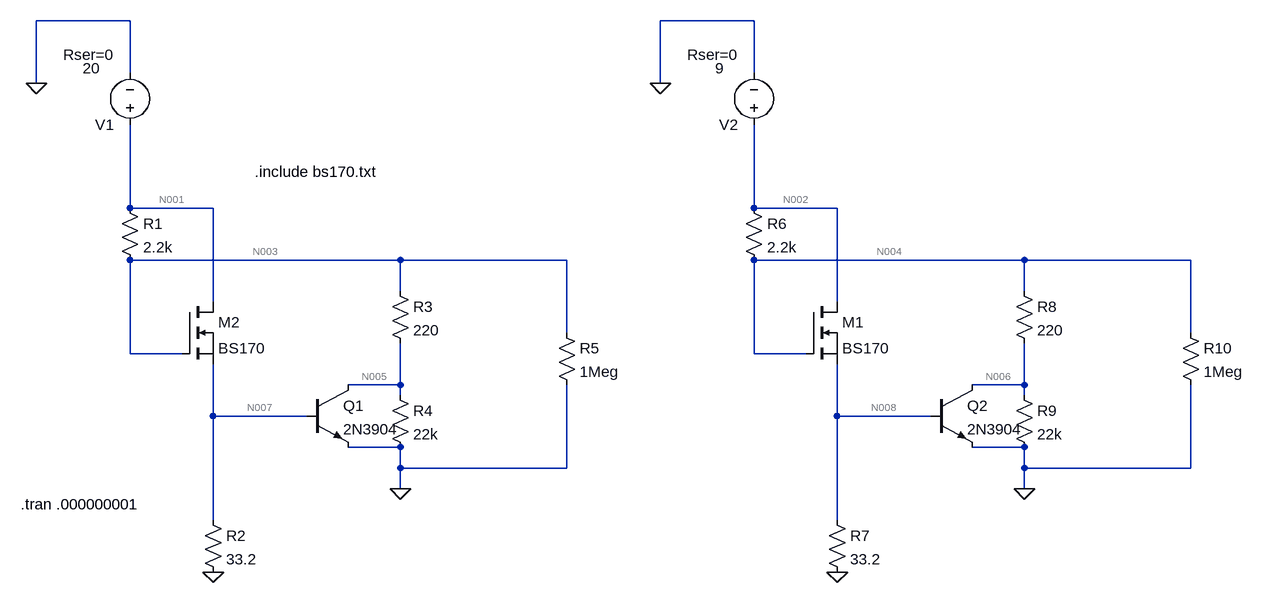
[diagram p0: schematic Bias Reference.asc]
Bias Reference.asc, the LTspice schematic file:
Version 4
SHEET 1 1864 1444
WIRE 144 -80 0 -80
WIRE 1104 -80 960 -80
WIRE 144 0 144 -80
WIRE 1104 0 1104 -80
WIRE 0 16 0 -80
WIRE 960 16 960 -80
WIRE 144 208 144 80
WIRE 272 208 144 208
WIRE 1104 208 1104 80
WIRE 1232 208 1104 208
WIRE 560 288 144 288
WIRE 816 288 560 288
WIRE 1520 288 1104 288
WIRE 1776 288 1520 288
WIRE 560 336 560 288
WIRE 1520 336 1520 288
WIRE 272 352 272 208
WIRE 1232 352 1232 208
WIRE 816 400 816 288
WIRE 1776 400 1776 288
WIRE 144 432 144 288
WIRE 224 432 144 432
WIRE 1104 432 1104 288
WIRE 1184 432 1104 432
WIRE 560 480 560 416
WIRE 560 480 480 480
WIRE 1520 480 1520 416
WIRE 1520 480 1440 480
WIRE 560 496 560 480
WIRE 1520 496 1520 480
WIRE 272 528 272 448
WIRE 416 528 272 528
WIRE 1232 528 1232 448
WIRE 1376 528 1232 528
WIRE 560 576 480 576
WIRE 1520 576 1440 576
WIRE 560 608 560 576
WIRE 816 608 816 480
WIRE 816 608 560 608
WIRE 1520 608 1520 576
WIRE 1776 608 1776 480
WIRE 1776 608 1520 608
WIRE 560 640 560 608
WIRE 1520 640 1520 608
WIRE 272 688 272 528
WIRE 1232 688 1232 528
FLAG 0 16 0
FLAG 272 768 0
FLAG 560 640 0
FLAG 960 16 0
FLAG 1232 768 0
FLAG 1520 640 0
SYMBOL voltage 144 96 R180
WINDOW 123 0 0 Left 0
WINDOW 39 24 124 Left 2
WINDOW 3 46 103 Left 2
SYMATTR SpiceLine Rser=0
SYMATTR Value 20
SYMATTR InstName V1
SYMBOL res 128 192 R0
SYMATTR InstName R1
SYMATTR Value 2.2k
SYMBOL res 256 672 R0
SYMATTR InstName R2
SYMATTR Value 33.2
SYMBOL res 544 320 R0
SYMATTR InstName R3
SYMATTR Value 220
SYMBOL res 544 480 R0
SYMATTR InstName R4
SYMATTR Value 22k
SYMBOL npn 416 480 R0
SYMATTR InstName Q1
SYMATTR Value 2N3904
SYMBOL res 800 384 R0
SYMATTR InstName R5
SYMATTR Value 1Meg
SYMBOL nmos 224 352 R0
SYMATTR InstName M2
SYMATTR Value BS170
SYMATTR Prefix X
SYMBOL voltage 1104 96 R180
WINDOW 123 0 0 Left 0
WINDOW 39 24 124 Left 2
WINDOW 3 46 103 Left 2
SYMATTR SpiceLine Rser=0
SYMATTR Value 9
SYMATTR InstName V2
SYMBOL res 1088 192 R0
SYMATTR InstName R6
SYMATTR Value 2.2k
SYMBOL res 1216 672 R0
SYMATTR InstName R7
SYMATTR Value 33.2
SYMBOL res 1504 320 R0
SYMATTR InstName R8
SYMATTR Value 220
SYMBOL res 1504 480 R0
SYMATTR InstName R9
SYMATTR Value 22k
SYMBOL npn 1376 480 R0
SYMATTR InstName Q2
SYMATTR Value 2N3904
SYMBOL res 1760 384 R0
SYMATTR InstName R10
SYMATTR Value 1Meg
SYMBOL nmos 1184 352 R0
SYMATTR InstName M1
SYMATTR Value BS170
SYMATTR Prefix X
TEXT -24 664 Left 2 !.tran .000000001
TEXT 336 152 Left 2 !.include bs170.txt

The netlist it stands for:
* Bias Reference.asc
V1 N001 0 20 Rser=0
R1 N001 N003 2.2k
R2 N007 0 33.2
R3 N003 N005 220
R4 N005 0 22k
Q1 N005 N007 0 0 2N3904
R5 N003 0 1Meg
XM2 N001 N003 N007 BS170  ; pins D G S
V2 N002 0 9 Rser=0
R6 N002 N004 2.2k
R7 N008 0 33.2
R8 N004 N006 220
R9 N006 0 22k
Q2 N006 N008 0 0 2N3904
R10 N004 0 1Meg
XM1 N002 N004 N008 BS170  ; pins D G S
.model NPN NPN
.model PNP PNP
.lib standard.bjt
.tran .000000001
.include bs170.txt
.backanno
.end

* Results of the author's LTspice run, read from the files saved beside the schematic
* Operating Point, zero values left out:
*   V(n001) = 20 V
*   V(n003) = 3.36 V
*   V(n007) = 708.6 mV
*   V(n005) = 1.697 V
*   V(n002) = 9 V
*   V(n004) = 3.316 V
*   V(n008) = 678.4 mV
*   V(n006) = 2.748 V
*   Ic(Q2) = 2.456 mA
*   Ib(Q2) = 8.067 µA
*   Ie(Q2) = -2.464 mA
*   Ic(Q1) = 7.483 mA
*   Ib(Q1) = 25.16 µA
*   Ie(Q1) = -7.508 mA
*   I(R10) = 3.316 µA
*   I(R9) = 124.9 µA
*   I(R8) = 2.58 mA
*   I(R7) = 20.43 mA
*   I(R6) = 2.584 mA
*   I(R5) = 3.36 µA
*   I(R4) = 77.14 µA
*   I(R3) = 7.56 mA
*   I(R2) = 21.34 mA
*   I(R1) = 7.564 mA
*   I(V2) = -23.03 mA
*   I(V1) = -28.93 mA
*   Ix(m2:1) = 21.37 mA
*   Ix(m2:3) = -21.37 mA
*   Ix(m1:1) = 20.44 mA
*   Ix(m1:3) = -20.44 mA